# Altium schematic sheet Amp_IF.SchDoc: IF Amplifier
size A4; Author: Almela; Revision: 1.2; SheetNumber: 7; SheetTotal: 7
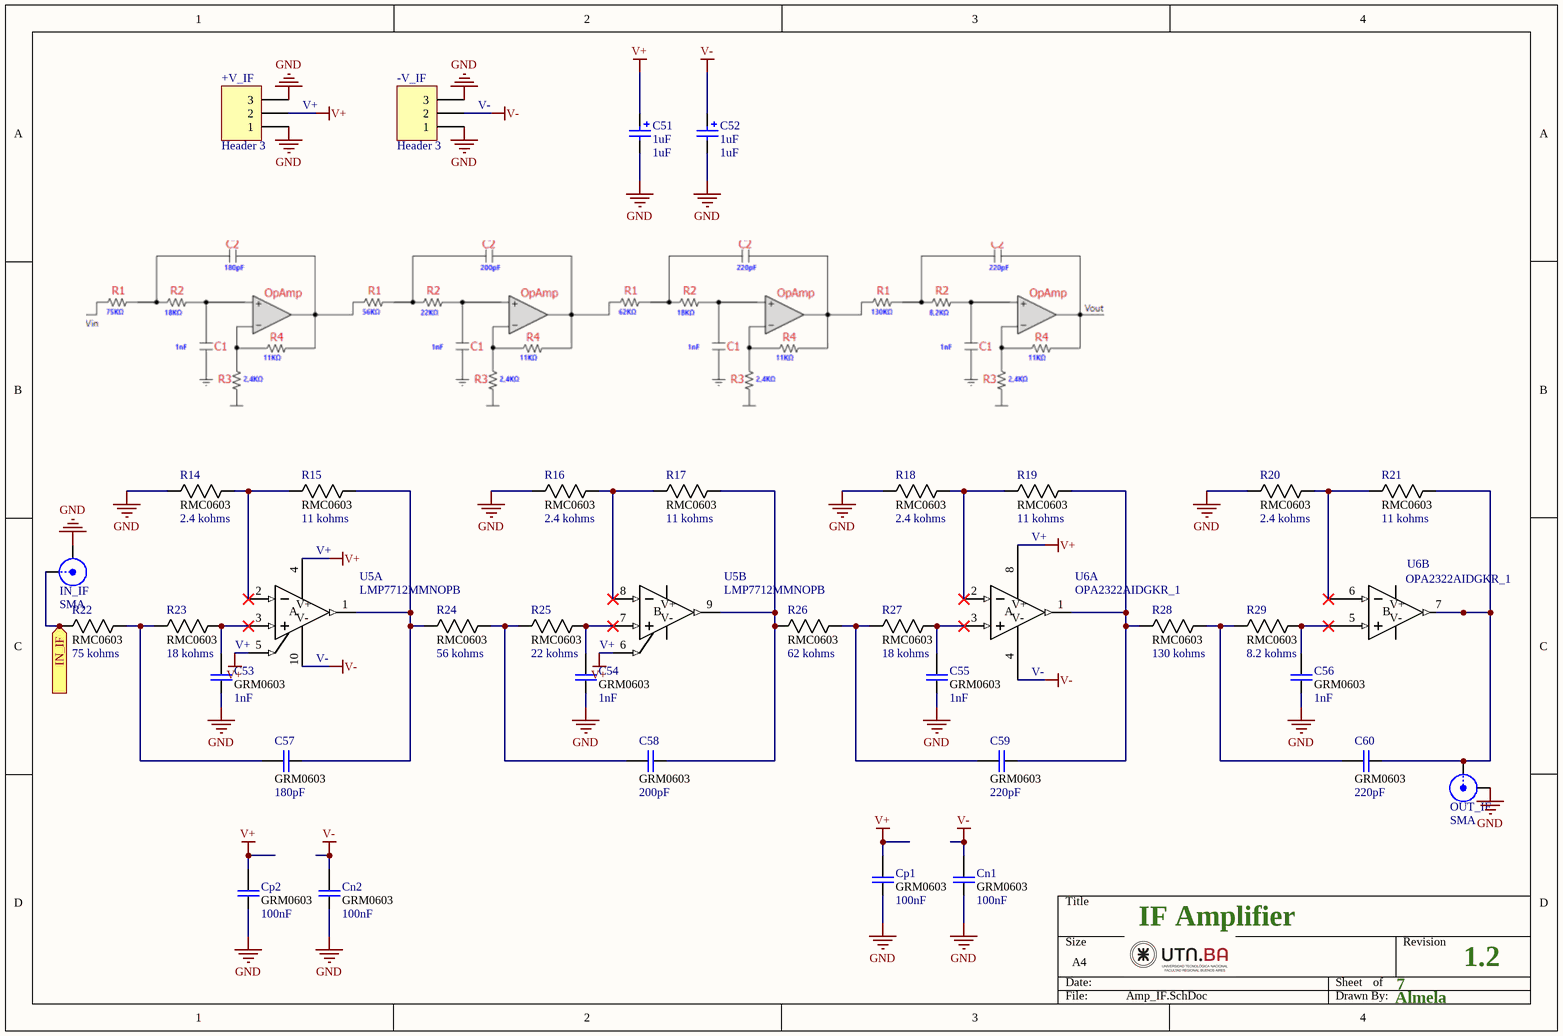
[diagram p0: Amp_IF.SchDoc]

## Parts
+V_IF  Header 3  [HDR1X3]
-V_IF  Header 3  [HDR1X3]
C51  1uF  [6-0805_N]
C52  1uF  [6-0805_N]
C53  value 1nF  footprint: GRM0603  [CAPC1608X90N]  (hidden comment: Cap 0603)
C54  value 1nF  footprint: GRM0603  [CAPC1608X90N]  (hidden comment: Cap 0603)
C55  value 1nF  footprint: GRM0603  [CAPC1608X90N]  (hidden comment: Cap 0603)
C56  value 1nF  footprint: GRM0603  [CAPC1608X90N]  (hidden comment: Cap 0603)
C57  value 180pF  footprint: GRM0603  [CAPC1608X90N]  (hidden comment: Cap 0603)
C58  value 200pF  footprint: GRM0603  [CAPC1608X90N]  (hidden comment: Cap 0603)
C59  value 220pF  footprint: GRM0603  [CAPC1608X90N]  (hidden comment: Cap 0603)
C60  value 220pF  footprint: GRM0603  [CAPC1608X90N]  (hidden comment: Cap 0603)
Cn1  value 100nF  footprint: GRM0603  [CAPC1608X90N]  (hidden comment: Cap 0603)
Cn2  value 100nF  footprint: GRM0603  [CAPC1608X90N]  (hidden comment: Cap 0603)
Cp1  value 100nF  footprint: GRM0603  [CAPC1608X90N]  (hidden comment: Cap 0603)
Cp2  value 100nF  footprint: GRM0603  [CAPC1608X90N]  (hidden comment: Cap 0603)
IN_IF  SMA  [SMA-142-0701-851]
OUT_IF  SMA  [SMA-142-0701-851]
R14  value 2.4 kohms  footprint: RMC0603  [RESC1508X55N]  (hidden comment: Resistor)
R15  value 11 kohms  footprint: RMC0603  [RESC1508X55N]  (hidden comment: Resistor)
R16  value 2.4 kohms  footprint: RMC0603  [RESC1508X55N]  (hidden comment: Resistor)
R17  value 11 kohms  footprint: RMC0603  [RESC1508X55N]  (hidden comment: Resistor)
R18  value 2.4 kohms  footprint: RMC0603  [RESC1508X55N]  (hidden comment: Resistor)
R19  value 11 kohms  footprint: RMC0603  [RESC1508X55N]  (hidden comment: Resistor)
R20  value 2.4 kohms  footprint: RMC0603  [RESC1508X55N]  (hidden comment: Resistor)
R21  value 11 kohms  footprint: RMC0603  [RESC1508X55N]  (hidden comment: Resistor)
R22  value 75 kohms  footprint: RMC0603  [RESC1508X55N]  (hidden comment: Resistor)
R23  value 18 kohms  footprint: RMC0603  [RESC1508X55N]  (hidden comment: Resistor)
R24  value 56 kohms  footprint: RMC0603  [RESC1508X55N]  (hidden comment: Resistor)
R25  value 22 kohms  footprint: RMC0603  [RESC1508X55N]  (hidden comment: Resistor)
R26  value 62 kohms  footprint: RMC0603  [RESC1508X55N]  (hidden comment: Resistor)
R27  value 18 kohms  footprint: RMC0603  [RESC1508X55N]  (hidden comment: Resistor)
R28  value 130 kohms  footprint: RMC0603  [RESC1508X55N]  (hidden comment: Resistor)
R29  value 8.2 kohms  footprint: RMC0603  [RESC1508X55N]  (hidden comment: Resistor)
U5  LMP7712MMNOPB  [SOP50P490X110-10N]  (parts A,B of 2)
U6  OPA2322AIDGKR_1  [DGK8]  (parts A,B of 2)

## Ports
IN_IF (in)

## Nets
GND: +V_IF.1 +V_IF.3 -V_IF.1 -V_IF.3 C51.2 C52.2 C53.1 C54.1 C55.1 C56.1 Cn1.1 Cn2.1 Cp1.1 Cp2.1 IN_IF.2(Y) OUT_IF.2(Y) R14.1 R16.1 R18.1 R20.1
V+: +V_IF.2 C51.1 Cp1.2 Cp2.2 U5.4(V-) U5.5(SD1) U5.6(SD2) U6.8(V+)
V-: -V_IF.2 C52.1 Cn1.2 Cn2.2 U5.10(V+) U6.4(V-)
IN_IF: IN_IF.1(X) R22.1 ; port IN_IF
NetC53_2: C53.2 R23.2 U5.3(IN+)
NetC54_2: C54.2 R25.2 U5.7(IN+)
NetC55_2: C55.2 R27.2 U6.3(IN+)
NetC56_2: C56.2 R29.2 U6.5(INB+)
NetC57_1: C57.1 R15.2 R24.1 U5.1(OUT)
NetC57_2: C57.2 R22.2 R23.1
NetC58_1: C58.1 R17.2 R26.1 U5.9(OUT)
NetC58_2: C58.2 R24.2 R25.1
NetC59_1: C59.1 R19.2 R28.1 U6.1(OUT)
NetC59_2: C59.2 R26.2 R27.1
NetC60_1: C60.1 OUT_IF.1(X) R21.2 U6.7(OUTB)
NetC60_2: C60.2 R28.2 R29.1
NetR14_2: R14.2 R15.1 U5.2(IN-)
NetR16_2: R16.2 R17.1 U5.8(IN-)
NetR18_2: R18.2 R19.1 U6.2(IN-)
NetR20_2: R20.2 R21.1 U6.6(INB-)

## Notes on the sheet
- (near +V_IF) V+
- (near -V_IF) V-
- (near U5) V+
- V+
- (near U5) V-
- (near U6) V-
- (in symbol LMP7712MMNOPB, part A) A
- (in symbol LMP7712MMNOPB, part B) B
- (in symbol OPA2322AIDGKR_1, part A) A
- (in symbol OPA2322AIDGKR_1, part B) B

## Library data of the parts
+V_IF -V_IF = Header 3: Header, 3-Pin; LatestRevisionDate: 17-Jul-2002; LatestRevisionNote: Re-released for DXP Platform.; Publisher: Altium Limited
C51 C52 = Cap Pol2_1: Polarized Capacitor (Axial); Published: 8-Jun-2000; LatestRevisionDate: 17-Jul-2002; LatestRevisionNote: Re-released for DXP Platform.; PackageReference: POLAR0.8; Publisher: Altium Limited; PackageDescription: Polarized Capacitor; 2 Leads; Value: 1uF
C53-C60 Cn1 Cn2 Cp1 Cp2 = Cap: Capacitor GRM18 0603; Published: 8-Jun-2000; LatestRevisionDate: 17-Jul-2002; LatestRevisionNote: Re-released for DXP Platform.; PackageReference: POLAR0.8; Publisher: Altium Limited; PackageDescription: Polarized Capacitor; 2 Leads; Supplier 1: Mouser
IN_IF OUT_IF = SMA: SMA Straight Connector; LatestRevisionDate: 17-Jul-2002; LatestRevisionNote: Re-released for DXP Platform.; Publisher: Altium Limited
R14-R29 = Resistor: Resistor RMC0603; Mfr_Name: Stackpole International
U5 = LMP7712MMNOPB: No Description Available; Mfr_Name: Texas Instruments; Manufacturer: NationalSemiconductor; Characteristics: LMP7712MM18VPrecisonDualLowNoiseCMOSInputOpAmpwithShutdown; CompType: OpAmpIC; TaMin_C: -400; TaMax_C: 1250; ComponentLink1DescBC: LMP7712Datasheet; ComponentLink2DescA4: LMP7712WebPage; ComponentLink3DescAC: MUB10APackageWebPage; SymbolVersion: 2008-07-09; PartNumber: LMP7712MM; PackageDescription: 10LeadMSOP; PackageReference: MUB10A_L; RoHS: O; ComponentLink1URL: http//wwwnationalcom/ds/LM/LMP7712pdf; ComponentLink2URL: http//wwwnationalcom/pf/LM/LMP7712html; ComponentLink3URL: http//wwwnationalcom/packaging/folders/mub10ahtml; Version: B1608; LatestRevisionDate: 2009-03-16; LatestRevisionNote: MassUpdate; Publisher: NationalSemiconductor; Published: 2009-03-16
U6 = OPA2322AIDGKR_1: No Description Available; Mfr_Name: Texas Instruments; RefDes: RefDes; Type: Type